# EasyEDA schematic SCH_MCP23X17 smaller chips_2021-12-25.json
TITLE: Sheet_1; REV: 1.0; Date: 2021-12-15; Sheet: 1/1; Drawn By: limchengwei; Company: Your Company
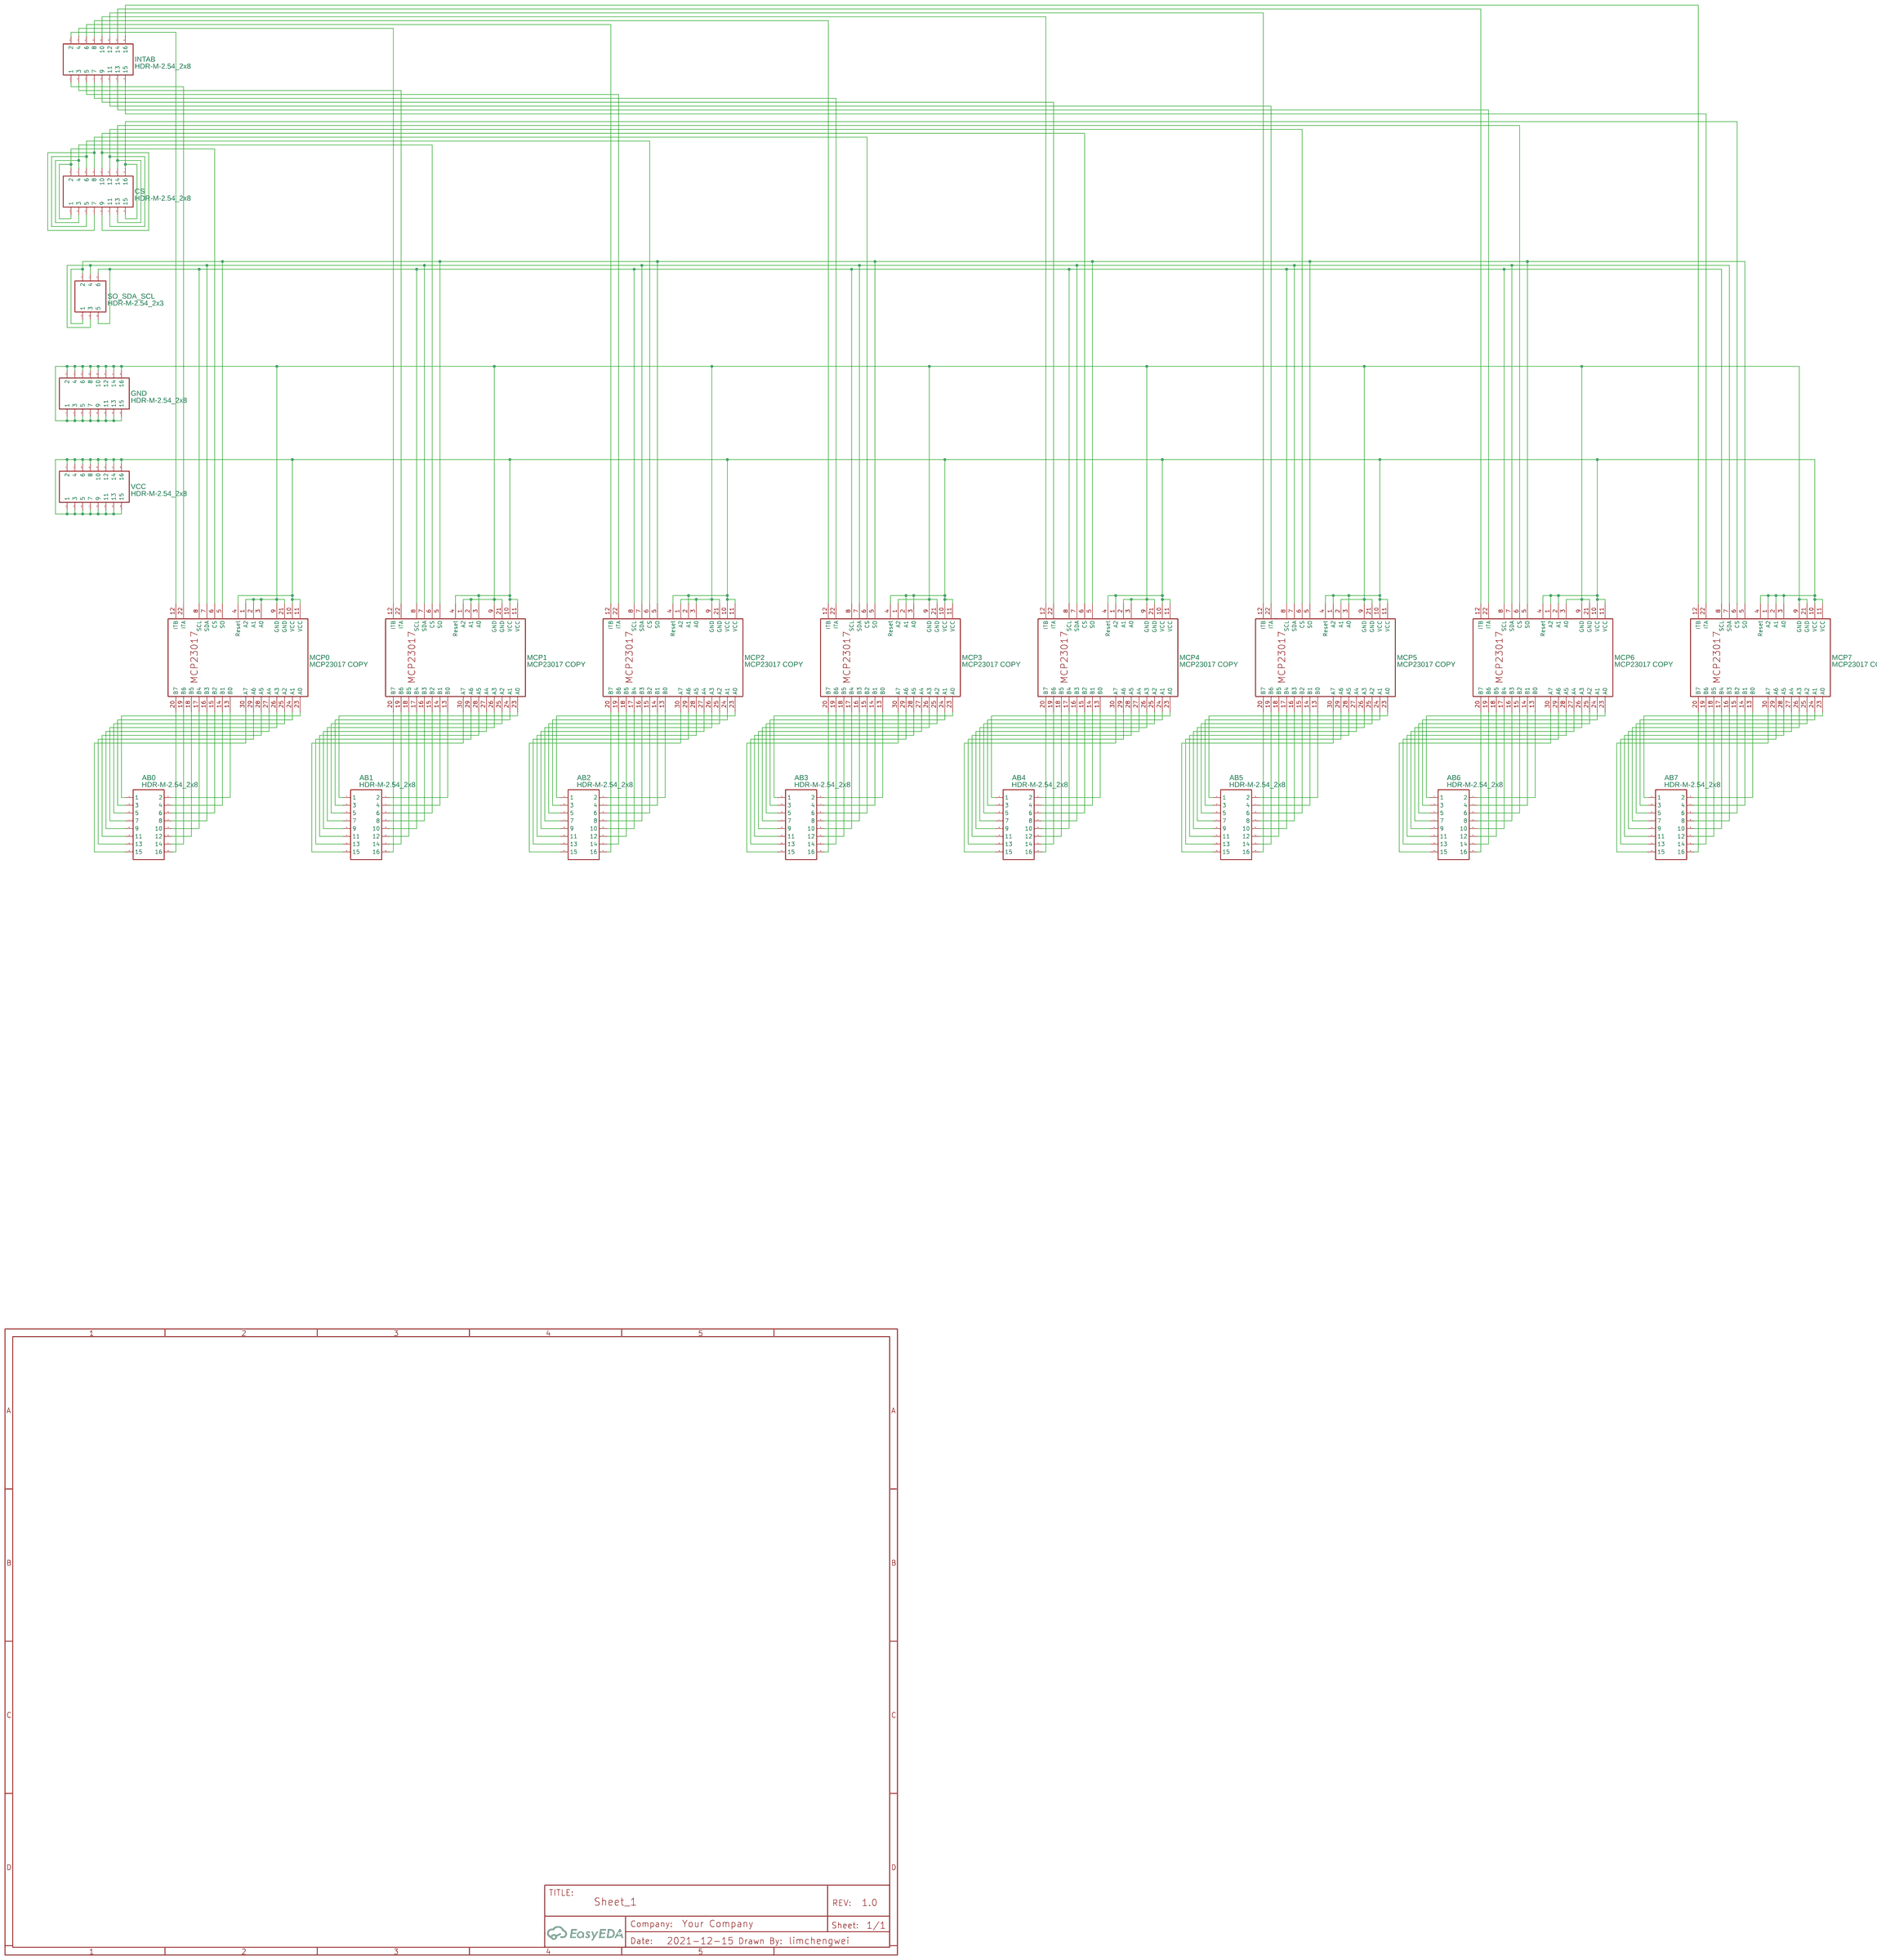
[diagram p0: schematic sheet]

## Parts
AB0  HDR-M-2.54_2x8  [HDR-M-2.54_2X8]
AB1  HDR-M-2.54_2x8  [HDR-M-2.54_2X8]
AB2  HDR-M-2.54_2x8  [HDR-M-2.54_2X8]
AB3  HDR-M-2.54_2x8  [HDR-M-2.54_2X8]
AB4  HDR-M-2.54_2x8  [HDR-M-2.54_2X8]
AB5  HDR-M-2.54_2x8  [HDR-M-2.54_2X8]
AB6  HDR-M-2.54_2x8  [HDR-M-2.54_2X8]
AB7  HDR-M-2.54_2x8  [HDR-M-2.54_2X8]
CS  HDR-M-2.54_2x8  [HDR-M-2.54_2X8]
GND  HDR-M-2.54_2x8  [HDR-M-2.54_2X8]
INTAB  HDR-M-2.54_2x8  [HDR-M-2.54_2X8]
MCP0  MCP23017 COPY  [MCP23017]
MCP1  MCP23017 COPY  [MCP23017]
MCP2  MCP23017 COPY  [MCP23017]
MCP3  MCP23017 COPY  [MCP23017]
MCP4  MCP23017 COPY  [MCP23017]
MCP5  MCP23017 COPY  [MCP23017]
MCP6  MCP23017 COPY  [MCP23017]
MCP7  MCP23017 COPY  [MCP23017]
SO_SDA_SCL  HDR-M-2.54_2x3  [HDR-M-2.54_2X3]
VCC  HDR-M-2.54_2x8  [HDR-M-2.54_2X8]

## Library data of the parts
AB0-AB7 CS GND INTAB VCC = HDR-M-2.54_2x8: Supplier Part: C68234; Supplier: LCSC; Contributor: LCEDA_Lib
MCP0-MCP7 = MCP23017 COPY: Contributor: emmanuel.malosse
SO_SDA_SCL = HDR-M-2.54_2x3: Supplier Part: C65114; Supplier: LCSC; Contributor: LCEDA_Lib

## Nets
Net-(AB0-1): AB0.1 MCP0.23(A0)
Net-(AB0-2): AB0.2 MCP0.13(B0)
Net-(AB0-3): AB0.3 MCP0.24(A1)
Net-(AB0-4): AB0.4 MCP0.14(B1)
Net-(AB0-5): AB0.5 MCP0.25(A2)
Net-(AB0-6): AB0.6 MCP0.15(B2)
Net-(AB0-7): AB0.7 MCP0.26(A3)
Net-(AB0-8): AB0.8 MCP0.16(B3)
Net-(AB0-9): AB0.9 MCP0.27(A4)
Net-(AB0-10): AB0.10 MCP0.17(B4)
Net-(AB0-11): AB0.11 MCP0.28(A5)
Net-(AB0-12): AB0.12 MCP0.18(B5)
Net-(AB0-13): AB0.13 MCP0.29(A6)
Net-(AB0-14): AB0.14 MCP0.19(B6)
Net-(AB0-15): AB0.15 MCP0.30(A7)
Net-(AB0-16): AB0.16 MCP0.20(B7)
Net-(AB1-1): AB1.1 MCP1.23(A0)
Net-(AB1-2): AB1.2 MCP1.13(B0)
Net-(AB1-3): AB1.3 MCP1.24(A1)
Net-(AB1-4): AB1.4 MCP1.14(B1)
Net-(AB1-5): AB1.5 MCP1.25(A2)
Net-(AB1-6): AB1.6 MCP1.15(B2)
Net-(AB1-7): AB1.7 MCP1.26(A3)
Net-(AB1-8): AB1.8 MCP1.16(B3)
Net-(AB1-9): AB1.9 MCP1.27(A4)
Net-(AB1-10): AB1.10 MCP1.17(B4)
Net-(AB1-11): AB1.11 MCP1.28(A5)
Net-(AB1-12): AB1.12 MCP1.18(B5)
Net-(AB1-13): AB1.13 MCP1.29(A6)
Net-(AB1-14): AB1.14 MCP1.19(B6)
Net-(AB1-15): AB1.15 MCP1.30(A7)
Net-(AB1-16): AB1.16 MCP1.20(B7)
Net-(AB2-1): AB2.1 MCP2.23(A0)
Net-(AB2-2): AB2.2 MCP2.13(B0)
Net-(AB2-3): AB2.3 MCP2.24(A1)
Net-(AB2-4): AB2.4 MCP2.14(B1)
Net-(AB2-5): AB2.5 MCP2.25(A2)
Net-(AB2-6): AB2.6 MCP2.15(B2)
Net-(AB2-7): AB2.7 MCP2.26(A3)
Net-(AB2-8): AB2.8 MCP2.16(B3)
Net-(AB2-9): AB2.9 MCP2.27(A4)
Net-(AB2-10): AB2.10 MCP2.17(B4)
Net-(AB2-11): AB2.11 MCP2.28(A5)
Net-(AB2-12): AB2.12 MCP2.18(B5)
Net-(AB2-13): AB2.13 MCP2.29(A6)
Net-(AB2-14): AB2.14 MCP2.19(B6)
Net-(AB2-15): AB2.15 MCP2.30(A7)
Net-(AB2-16): AB2.16 MCP2.20(B7)
Net-(AB3-1): AB3.1 MCP3.23(A0)
Net-(AB3-2): AB3.2 MCP3.13(B0)
Net-(AB3-3): AB3.3 MCP3.24(A1)
Net-(AB3-4): AB3.4 MCP3.14(B1)
Net-(AB3-5): AB3.5 MCP3.25(A2)
Net-(AB3-6): AB3.6 MCP3.15(B2)
Net-(AB3-7): AB3.7 MCP3.26(A3)
Net-(AB3-8): AB3.8 MCP3.16(B3)
Net-(AB3-9): AB3.9 MCP3.27(A4)
Net-(AB3-10): AB3.10 MCP3.17(B4)
Net-(AB3-11): AB3.11 MCP3.28(A5)
Net-(AB3-12): AB3.12 MCP3.18(B5)
Net-(AB3-13): AB3.13 MCP3.29(A6)
Net-(AB3-14): AB3.14 MCP3.19(B6)
Net-(AB3-15): AB3.15 MCP3.30(A7)
Net-(AB3-16): AB3.16 MCP3.20(B7)
Net-(AB4-1): AB4.1 MCP4.23(A0)
Net-(AB4-2): AB4.2 MCP4.13(B0)
Net-(AB4-3): AB4.3 MCP4.24(A1)
Net-(AB4-4): AB4.4 MCP4.14(B1)
Net-(AB4-5): AB4.5 MCP4.25(A2)
Net-(AB4-6): AB4.6 MCP4.15(B2)
Net-(AB4-7): AB4.7 MCP4.26(A3)
Net-(AB4-8): AB4.8 MCP4.16(B3)
Net-(AB4-9): AB4.9 MCP4.27(A4)
Net-(AB4-10): AB4.10 MCP4.17(B4)
Net-(AB4-11): AB4.11 MCP4.28(A5)
Net-(AB4-12): AB4.12 MCP4.18(B5)
Net-(AB4-13): AB4.13 MCP4.29(A6)
Net-(AB4-14): AB4.14 MCP4.19(B6)
Net-(AB4-15): AB4.15 MCP4.30(A7)
Net-(AB4-16): AB4.16 MCP4.20(B7)
Net-(AB5-1): AB5.1 MCP5.23(A0)
Net-(AB5-2): AB5.2 MCP5.13(B0)
Net-(AB5-3): AB5.3 MCP5.24(A1)
Net-(AB5-4): AB5.4 MCP5.14(B1)
Net-(AB5-5): AB5.5 MCP5.25(A2)
Net-(AB5-6): AB5.6 MCP5.15(B2)
Net-(AB5-7): AB5.7 MCP5.26(A3)
Net-(AB5-8): AB5.8 MCP5.16(B3)
Net-(AB5-9): AB5.9 MCP5.27(A4)
Net-(AB5-10): AB5.10 MCP5.17(B4)
Net-(AB5-11): AB5.11 MCP5.28(A5)
Net-(AB5-12): AB5.12 MCP5.18(B5)
Net-(AB5-13): AB5.13 MCP5.29(A6)
Net-(AB5-14): AB5.14 MCP5.19(B6)
Net-(AB5-15): AB5.15 MCP5.30(A7)
Net-(AB5-16): AB5.16 MCP5.20(B7)
Net-(AB6-1): AB6.1 MCP6.23(A0)
Net-(AB6-2): AB6.2 MCP6.13(B0)
Net-(AB6-3): AB6.3 MCP6.24(A1)
Net-(AB6-4): AB6.4 MCP6.14(B1)
Net-(AB6-5): AB6.5 MCP6.25(A2)
Net-(AB6-6): AB6.6 MCP6.15(B2)
Net-(AB6-7): AB6.7 MCP6.26(A3)
Net-(AB6-8): AB6.8 MCP6.16(B3)
Net-(AB6-9): AB6.9 MCP6.27(A4)
Net-(AB6-10): AB6.10 MCP6.17(B4)
Net-(AB6-11): AB6.11 MCP6.28(A5)
Net-(AB6-12): AB6.12 MCP6.18(B5)
Net-(AB6-13): AB6.13 MCP6.29(A6)
Net-(AB6-14): AB6.14 MCP6.19(B6)
Net-(AB6-15): AB6.15 MCP6.30(A7)
Net-(AB6-16): AB6.16 MCP6.20(B7)
Net-(AB7-1): AB7.1 MCP7.23(A0)
Net-(AB7-2): AB7.2 MCP7.13(B0)
Net-(AB7-3): AB7.3 MCP7.24(A1)
Net-(AB7-4): AB7.4 MCP7.14(B1)
Net-(AB7-5): AB7.5 MCP7.25(A2)
Net-(AB7-6): AB7.6 MCP7.15(B2)
Net-(AB7-7): AB7.7 MCP7.26(A3)
Net-(AB7-8): AB7.8 MCP7.16(B3)
Net-(AB7-9): AB7.9 MCP7.27(A4)
Net-(AB7-10): AB7.10 MCP7.17(B4)
Net-(AB7-11): AB7.11 MCP7.28(A5)
Net-(AB7-12): AB7.12 MCP7.18(B5)
Net-(AB7-13): AB7.13 MCP7.29(A6)
Net-(AB7-14): AB7.14 MCP7.19(B6)
Net-(AB7-15): AB7.15 MCP7.30(A7)
Net-(AB7-16): AB7.16 MCP7.20(B7)
Net-(CS-1): CS.1 CS.2 MCP0.6(CS)
Net-(CS-3): CS.3 CS.4 MCP1.6(CS)
Net-(CS-5): CS.5 CS.6 MCP2.6(CS)
Net-(CS-7): CS.7 CS.8 MCP3.6(CS)
Net-(CS-9): CS.9 CS.10 MCP4.6(CS)
Net-(CS-11): CS.11 CS.12 MCP5.6(CS)
Net-(CS-13): CS.13 CS.14 MCP6.6(CS)
Net-(CS-15): CS.15 CS.16 MCP7.6(CS)
Net-(GND-1): GND.1 GND.2 GND.3 GND.4 GND.5 GND.6 GND.7 GND.8 GND.9 GND.10 GND.11 GND.12 GND.13 GND.14 GND.15 GND.16 MCP0.1(A2) MCP0.2(A1) MCP0.3(A0) MCP0.9(GND) MCP0.21(GND) MCP1.1(A2) MCP1.2(A1) MCP1.9(GND) MCP1.21(GND) MCP2.1(A2) MCP2.3(A0) MCP2.9(GND) MCP2.21(GND) MCP3.1(A2) MCP3.9(GND) MCP3.21(GND) MCP4.2(A1) MCP4.3(A0) MCP4.9(GND) MCP4.21(GND) MCP5.2(A1) MCP5.9(GND) MCP5.21(GND) MCP6.3(A0) MCP6.9(GND) MCP6.21(GND) MCP7.9(GND) MCP7.21(GND)
Net-(INTAB-1): INTAB.1 MCP0.22(ITA)
Net-(INTAB-2): INTAB.2 MCP0.12(ITB)
Net-(INTAB-3): INTAB.3 MCP1.22(ITA)
Net-(INTAB-4): INTAB.4 MCP1.12(ITB)
Net-(INTAB-5): INTAB.5 MCP2.22(ITA)
Net-(INTAB-6): INTAB.6 MCP2.12(ITB)
Net-(INTAB-7): INTAB.7 MCP3.22(ITA)
Net-(INTAB-8): INTAB.8 MCP3.12(ITB)
Net-(INTAB-9): INTAB.9 MCP4.22(ITA)
Net-(INTAB-10): INTAB.10 MCP4.12(ITB)
Net-(INTAB-11): INTAB.11 MCP5.22(ITA)
Net-(INTAB-12): INTAB.12 MCP5.12(ITB)
Net-(INTAB-13): INTAB.13 MCP6.22(ITA)
Net-(INTAB-14): INTAB.14 MCP6.12(ITB)
Net-(INTAB-15): INTAB.15 MCP7.22(ITA)
Net-(INTAB-16): INTAB.16 MCP7.12(ITB)
Net-(MCP0-4): MCP0.4(Reset) MCP0.10(VCC) MCP0.11(VCC) MCP1.3(A0) MCP1.4(Reset) MCP1.10(VCC) MCP1.11(VCC) MCP2.2(A1) MCP2.4(Reset) MCP2.10(VCC) MCP2.11(VCC) MCP3.2(A1) MCP3.3(A0) MCP3.4(Reset) MCP3.10(VCC) MCP3.11(VCC) MCP4.1(A2) MCP4.4(Reset) MCP4.10(VCC) MCP4.11(VCC) MCP5.1(A2) MCP5.3(A0) MCP5.4(Reset) MCP5.10(VCC) MCP5.11(VCC) MCP6.1(A2) MCP6.2(A1) MCP6.4(Reset) MCP6.10(VCC) MCP6.11(VCC) MCP7.1(A2) MCP7.2(A1) MCP7.3(A0) MCP7.4(Reset) MCP7.10(VCC) MCP7.11(VCC) VCC.1 VCC.2 VCC.3 VCC.4 VCC.5 VCC.6 VCC.7 VCC.8 VCC.9 VCC.10 VCC.11 VCC.12 VCC.13 VCC.14 VCC.15 VCC.16
Net-(MCP0-5): MCP0.5(SO) MCP1.5(SO) MCP2.5(SO) MCP3.5(SO) MCP4.5(SO) MCP5.5(SO) MCP6.5(SO) MCP7.5(SO) SO_SDA_SCL.1 SO_SDA_SCL.2
Net-(MCP0-7): MCP0.7(SDA) MCP1.7(SDA) MCP2.7(SDA) MCP3.7(SDA) MCP4.7(SDA) MCP5.7(SDA) MCP6.7(SDA) MCP7.7(SDA) SO_SDA_SCL.3 SO_SDA_SCL.4
Net-(MCP0-8): MCP0.8(SCL) MCP1.8(SCL) MCP2.8(SCL) MCP3.8(SCL) MCP4.8(SCL) MCP5.8(SCL) MCP6.8(SCL) MCP7.8(SCL) SO_SDA_SCL.5 SO_SDA_SCL.6
